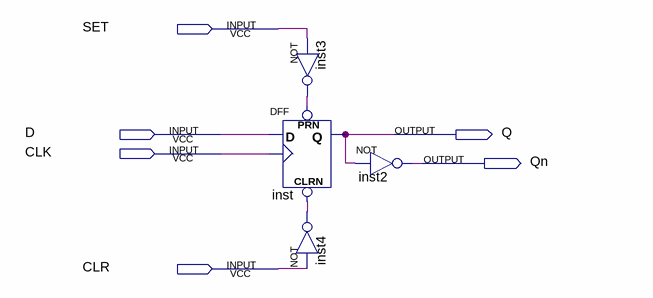
[diagram p0: schematic sheet]
// Quartus schematic D_FF.bdf as structural Verilog: 4 symbols, 6 pins
module D_FF (
  input  SET,
  input  D,
  input  CLK,
  input  CLR,
  output Q,
  output Qn
);

  wire inst3_out, inst4_out;

  DFF inst (.CLRN(inst4_out), .CLK(CLK), .D(D), .PRN(inst3_out), .Q(Q));
  not inst3 (inst3_out, SET);
  not inst4 (inst4_out, CLR);
  not inst2 (Qn, Q);
endmodule
